# Altium schematic sheet SME_S8261.SchDoc: Titulo
size OrCAD A; Author: Ismael Poblete V.; CompanyName: SME; Organization: SME; Address1: Santiago, Chile; DocumentNumber: SME-UNO; Revision: 1.0; SheetNumber: 6; SheetTotal: 7
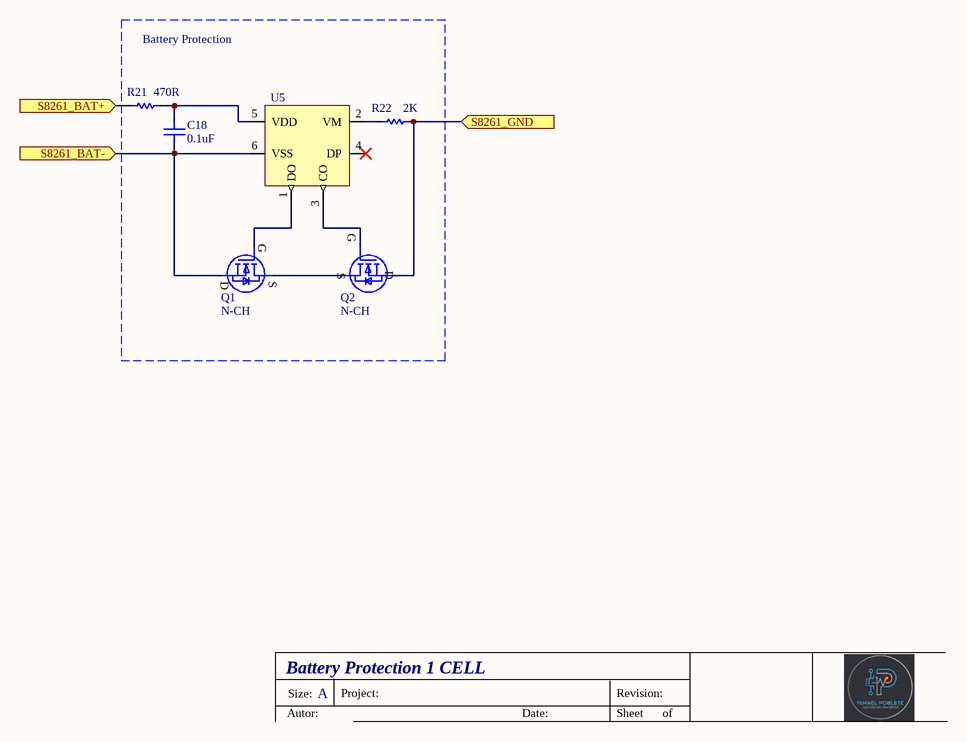
[diagram p0: SME_S8261.SchDoc]

## Parts
C18  Capacitance: 0.1uF  [C0603]  (hidden comment: CC0603KRX7R9BB104)
Q1  N-CH  [PowerPAK 1212-8-Pad]
Q2  N-CH  [PowerPAK 1212-8-Pad]
R21  Resistance: 470R  [RES_0603]  (hidden comment: RC0603FR-07470RL)
R22  Resistance: 2K  [RES_0603]  (hidden comment: RT0603DRD072KL)
U5  S-8261AAXMD-G2XT2U  [SOT95P275X135-6N]  (value not drawn)

## Blocks framed on the sheet
Battery Protection: C18 Q1 Q2 R21 R22 U5

## Ports
S8261_BAT+ (in, see SME_Main[1C]), S8261_BAT- (in, see SME_Main[1C]), S8261_GND (in, see SME_Main[2C])

## Nets
S8261_BAT+: R21.1 ; port S8261_BAT+
S8261_BAT-: C18.1 Q1.3(D) U5.6(VSS) ; port S8261_BAT-
S8261_GND: Q2.3(D) R22.2 ; port S8261_GND
NetC18_2: C18.2 R21.2 U5.5(VDD)
NetQ1_1: Q1.1(S) Q2.1(S)
NetQ1_2: Q1.2(G) U5.1(DO)
NetQ2_2: Q2.2(G) U5.3(CO)
NetR22_1: R22.1 U5.2(VM)

Not connected (* = marked no-connect by the designer): U5 4(DP)*

## Notes on the sheet
- Battery Protection 1 CELL
- Size:
- A
- Project:
- Revision:
- Autor:
- Date:
- Sheet
- of

## Library data of the parts
C18 = CC0603KRX7R9BB104: Multilayer Ceramic Capacitors MLCC - SMD/SMT 50 V 0.1uF X7R 0603 10%
Q1 Q2 = SI7106DN-T1-GE3: MOSFET (N-Channel); Manufacturer_Name: Vishay; Datasheet Link: https://www.arrow.com/en/products/si7106dn-t1-ge3/vishay; Height: 1.12mm; Manufacturer_Part_Number: SI7106DN-T1-GE3; Mouser Part Number: 781-SI7106DN-T1-GE3; Mouser Price/Stock: https://www.mouser.co.uk/ProductDetail/Vishay-Semiconductors/SI7106DN-T1-GE3?qs=tWM4QuTcS4UXbO9qkz0xcQ%3D%3D; Arrow Part Number: SI7106DN-T1-GE3; Arrow Price/Stock: https://www.arrow.com/en/products/si7106dn-t1-ge3/vishay?region=nac; ComponentLink1Description: New link; ComponentLink1URL: https://www.mouser.com/ProductDetail/Vishay-Semiconductors/SI7106DN-T1-GE3?qs=tWM4QuTcS4UXbO9qkz0xcQ%3D%3D
R21 = RC0603FR-07470RL: 470 Ohms ±1% 0.1W, 1/10W Chip Resistor 0603 (1608 Metric) Moisture Resistant Thick Film; Case/Package: 0603
R22 = RT0603DRD072KL: Thin Film Resistors - SMD 2K Ohm 0.5% 1/10W 75 Volts 25ppm; Case/Package: 0603
U5 = S-8261AAXMD-G2XT2U: Battery Battery Protection IC Lithium Ion/Polymer SOT-23-6